# EAGLE design 25062016wearable_v1.1 (EAGLE 7.6.0)
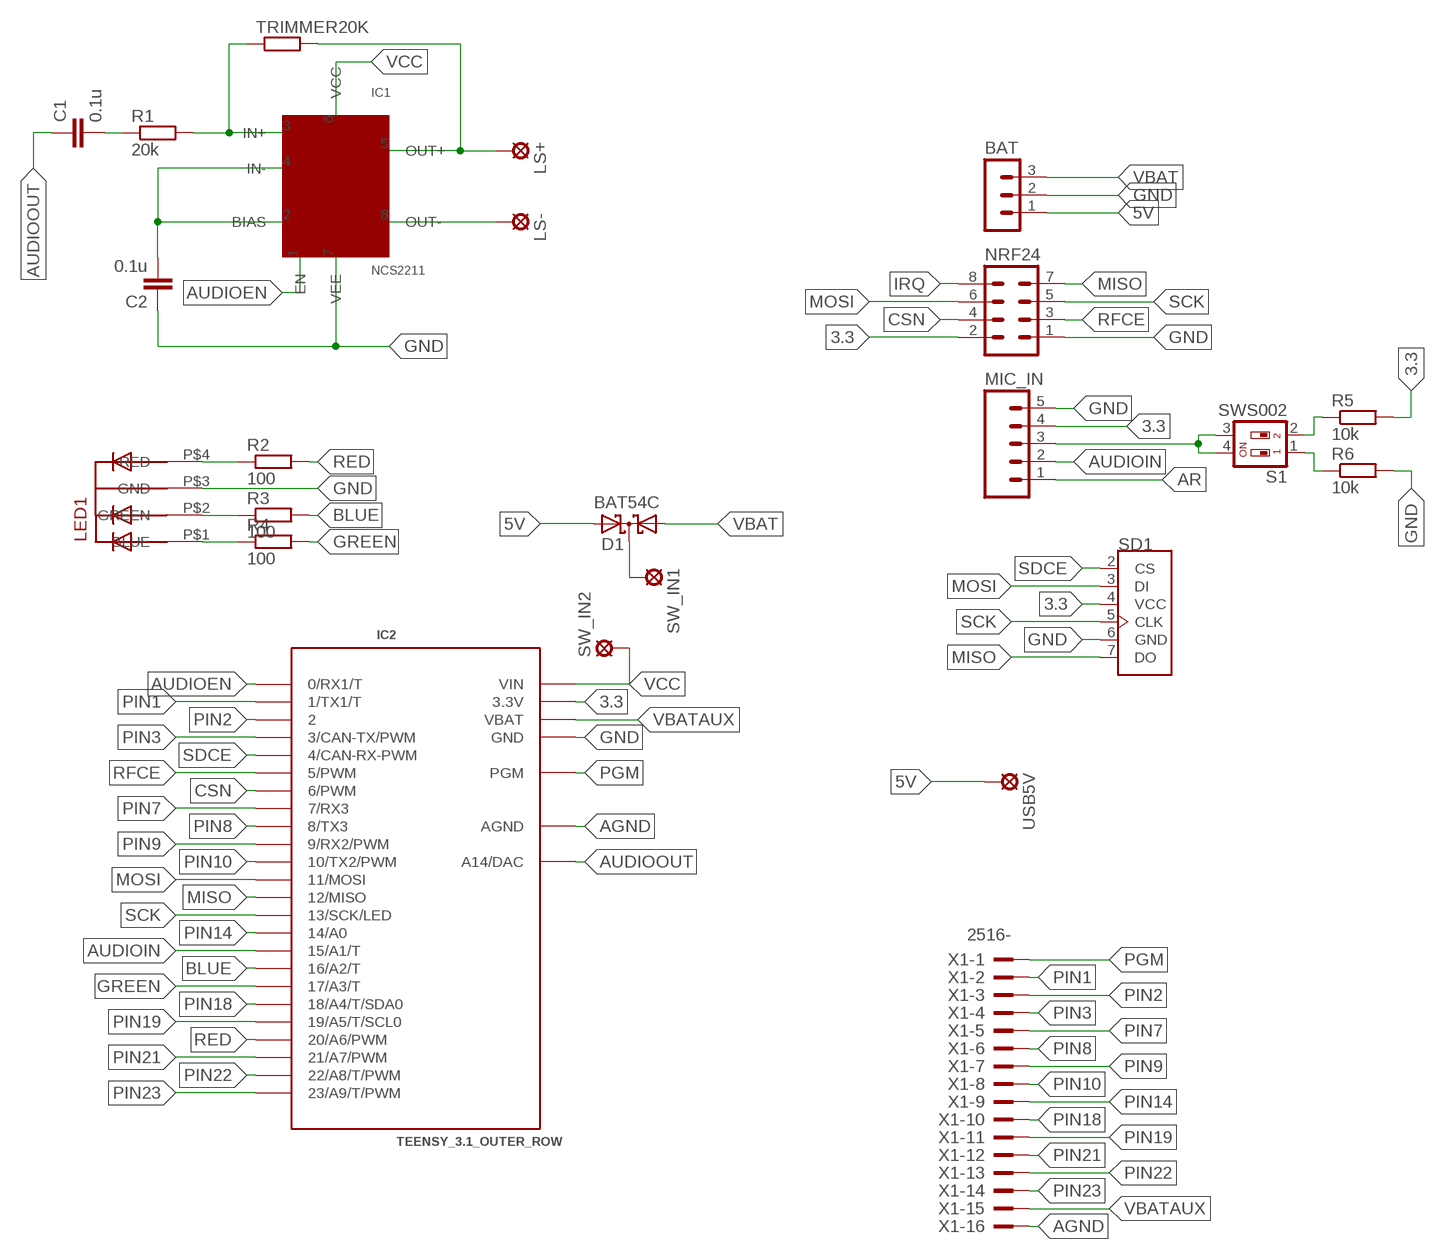
[diagram p0: schematic, sheet 1]

## Parts
BAT  MA03-1  [MA03-1]
C1  0.1u  C2.5/2  [C2.5-2]
C2  0.1u  C2.5/2  [C2.5-2]
D1  BAT54C  [SOT23]
IC1  NCS2211  [SOIC-8]
IC2  TEENSY_3.1_OUTER_ROW  [TEENSY3-OUTER_ROW]
LED1  5MMRGBLED  [LED5MMRGB]
LS+  LSP10  [LSP10]
LS-  LSP10  [LSP10]
MIC_IN  MA05  [05PA]
NRF24  MA04-2  [MA04-2]
R1  20k  R-EU_0204/7  [0204/7]
R2  100  R-EU_0207/2V  [0207/2V]
R3  100  R-EU_0207/2V  [0207/2V]
R4  100  R-EU_0207/2V  [0207/2V]
R5  10k  R-EU_0207/2V  [0207/2V]
R6  10k  R-EU_0207/2V  [0207/2V]
S1  SWS002  [SMS-002]
SD1  MICROSD_SF-MICROSD  [MICROSD_MICROSD]
SW_IN1  SE11  [SE11]
SW_IN2  SE11  [SE11]
TRIMMER20K  R-EU_0207/2V  [0207/2V]
USB5V  LSP10  [LSP10]
X1  2516-  [PAK100/2500-16]

## Nets
3.3 [3.3]: IC2.3.3V IC2.3.3V1(3.3V) MIC_IN.4 NRF24.2 R5.2 SD1.4(VCC)
5V [3.3]: BAT.1 D1.2(A2) USB5V.MP
AGND: IC2.AGND X1.16
AR: MIC_IN.1
AUDIOEN: IC1.1(EN) IC2.0(0/RX1/T)
AUDIOIN: IC2.15/A1(15/A1/T) MIC_IN.2
AUDIOOUT: C1.1 IC2.RESET/DAC(A14/DAC)
BLUE: IC2.16/A2(16/A2/T) R3.2
CSN: IC2.6(6/PWM) NRF24.4
GAIN: MIC_IN.3 S1.3 S1.4
GND [GND]: BAT.2 C2.1 IC1.7(VEE) IC2.GND IC2.GND1(GND) LED1.P$3(GND) MIC_IN.5 NRF24.1 R6.2 SD1.6(GND)
GREEN: IC2.17/A3(17/A3/T) R4.2
IRQ: NRF24.8
MISO: IC2.12(12/MISO) NRF24.7 SD1.7(DO)
MOSI: IC2.11(11/MOSI) NRF24.6 SD1.3(DI)
N$1: D1.3(CC) SW_IN1.MP
N$2: IC1.5(OUT+) LS+.MP TRIMMER20K.2
N$3: IC1.3(IN+) R1.2 TRIMMER20K.1
N$4: C1.2 R1.1
N$5: C2.2 IC1.2(BIAS) IC1.4(IN-)
N$6: IC1.8(OUT-) LS-.MP
N$7: LED1.P$4(RED) R2.1
N$8: LED1.P$1(BLUE) R4.1
N$9: LED1.P$2(GREEN) R3.1
N$11: R5.1 S1.2
N$12: R6.1 S1.1
PGM: IC2.PGM X1.1
PIN1: IC2.1(1/TX1/T) X1.2
PIN2: IC2.2 X1.3
PIN3: IC2.3(3/CAN-TX/PWM) X1.4
PIN7: IC2.7(7/RX3) X1.5
PIN8: IC2.8(8/TX3) X1.6
PIN9: IC2.9(9/RX2/PWM) X1.7
PIN10: IC2.10(10/TX2/PWM) X1.8
PIN14: IC2.14/A0 X1.9
PIN18: IC2.18/A4(18/A4/T/SDA0) X1.10
PIN19: IC2.19/A5(19/A5/T/SCL0) X1.11
PIN21: IC2.21/A7(21/A7/PWM) X1.12
PIN22: IC2.22/A8(22/A8/T/PWM) X1.13
PIN23: IC2.23/A9(23/A9/T/PWM) X1.14
RED: IC2.20/A6(20/A6/PWM) R2.2
RFCE: IC2.5(5/PWM) NRF24.3
SCK: IC2.13(13/SCK/LED) NRF24.5 SD1.5(CLK)
SDCE: IC2.4(4/CAN-RX-PWM) SD1.2(CS)
VBAT [3.3]: BAT.3 D1.1(A1)
VBATAUX: IC2.VBAT X1.15
VCC: IC1.6(VCC) IC2.VIN SW_IN2.MP

## Library data of the parts
BAT = con-lstb:MA03-1: PIN HEADER; OC_FARNELL: unknown; OC_NEWARK: unknown
C1 C2 = capacitor-wima:C: CAPACITOR naming: grid - package width
D1 = diode:BAT54C: Schottky Diodes Source: Fairchild .. BAT54.pdf
IC1 = NCS2211:NCS2211
IC2 = Teensy_3_and_LC_Series_Boards_v1.1:TEENSY_3.1_OUTER_ROW: Footprint for Teensy 3.1 or 3.2 board using all pin connections on the outer perimeter
LED1 = led_rgb:5MMRGBLED
LS+ LS- USB5V = solpad:LSP10: SOLDER PAD drill 1.0 mm, distributor Buerklin, 12H555
MIC_IN = con-amp-quick:MA05: AMP QUICK CONNECTOR; OC_FARNELL: unknown; OC_NEWARK: unknown
NRF24 = con-lstb:MA04-2: PIN HEADER; OC_FARNELL: unknown; OC_NEWARK: unknown
R1-R6 TRIMMER20K = rcl:R-EU_: RESISTOR, European symbol
S1 = smd-special:SWS002: SMD Dip Switch 2 pol.
SD1 = sd:MICROSD_SF-MICROSD
SW_IN1 SW_IN2 = solpad:SE11: SOLDER PAD RTM, drill 1,1mm, distributor Buerklin, 07F810
X1 = con-3m:2516-: 3M (TM) Pak 100 4-Wall Header Source: 3M; OC_FARNELL: unknown; OC_NEWARK: unknown

## Net classes
0 default: width 0.406 mm
1 GND: width 0.61 mm
2 3.3: width 0.61 mm

## Board
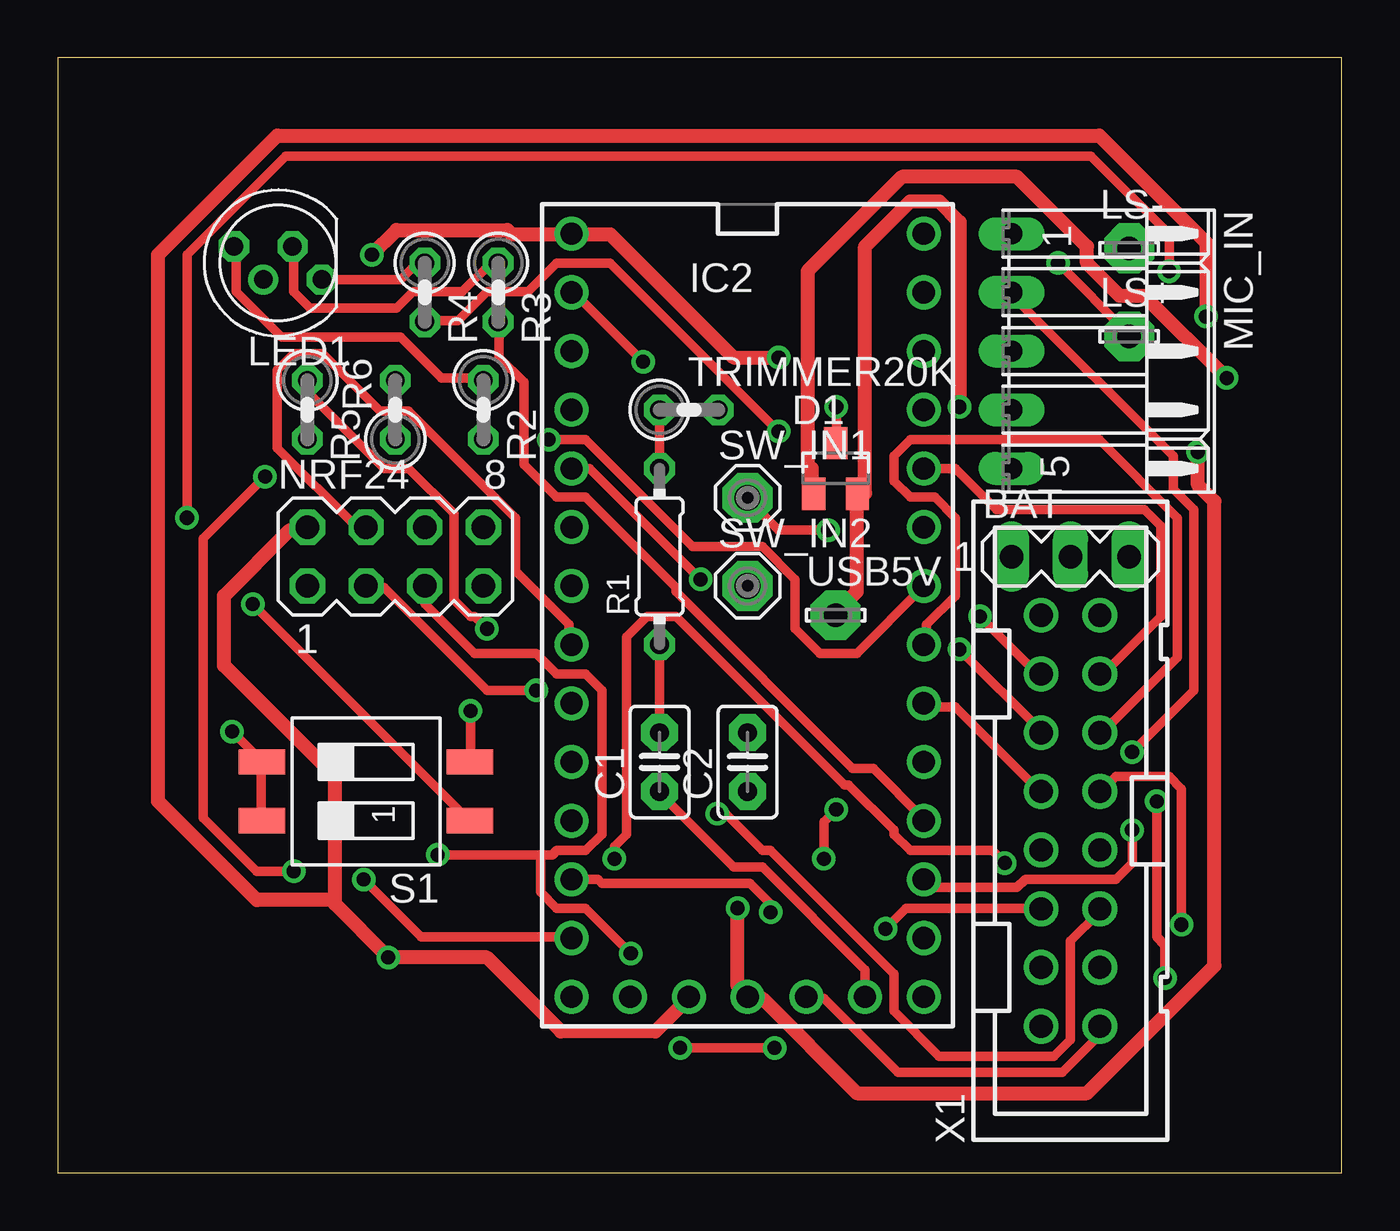
[diagram p1: board, top side]
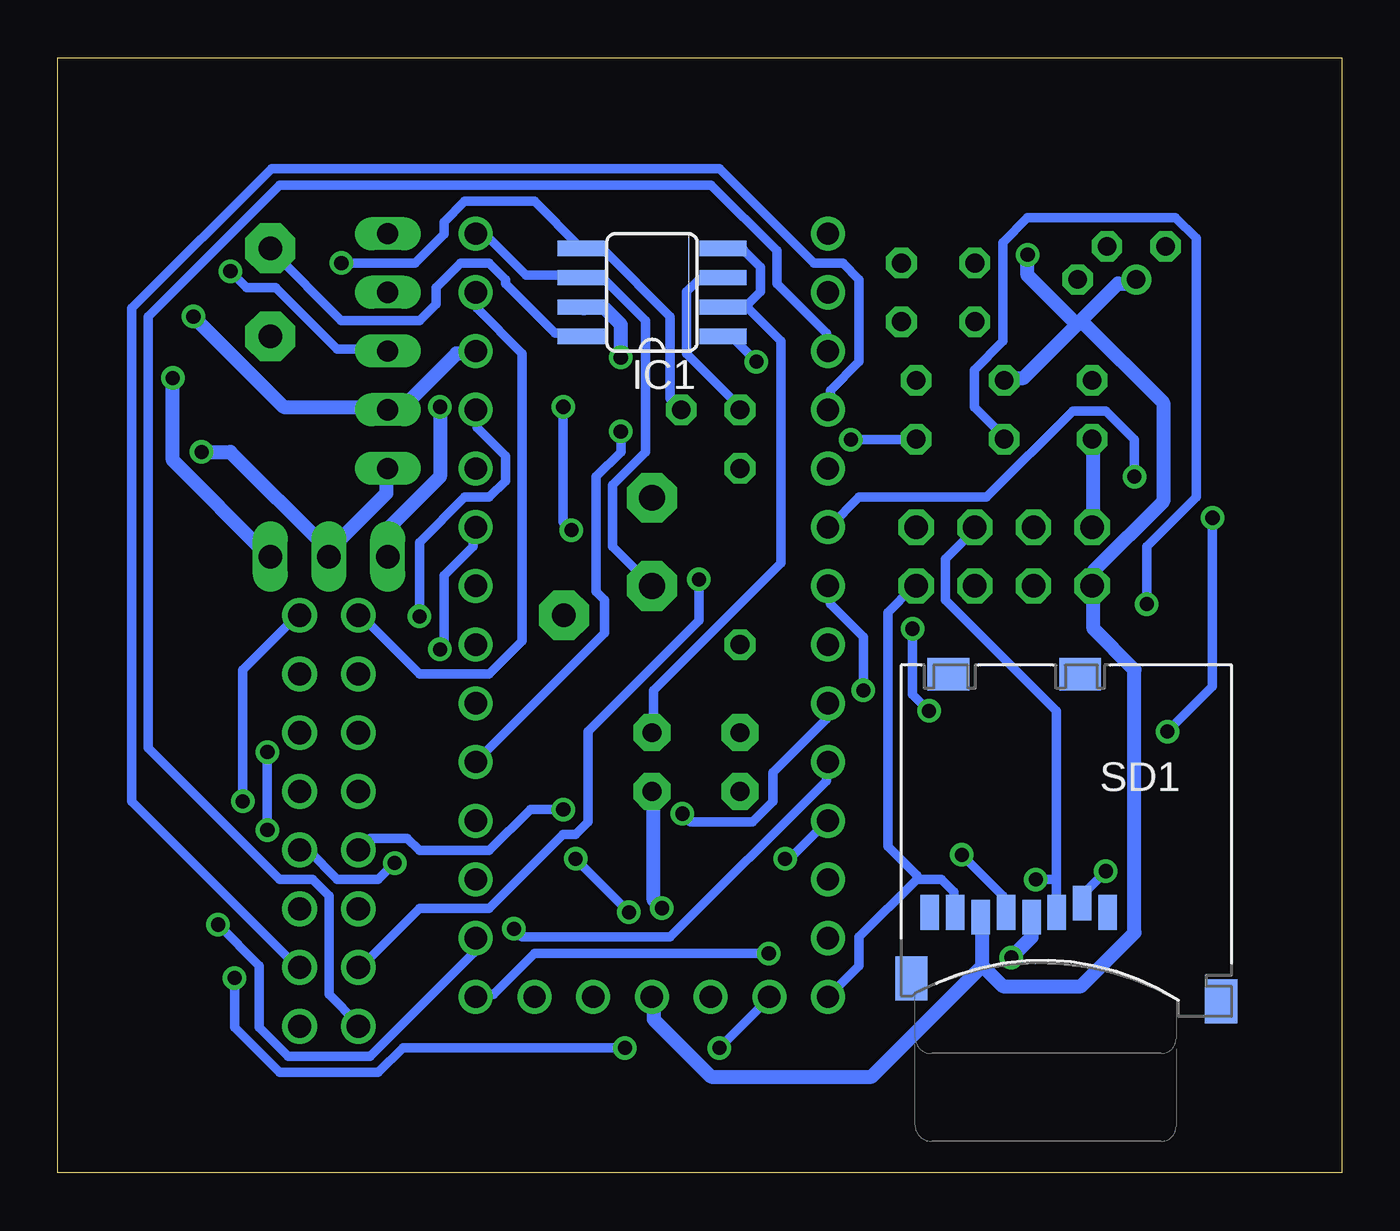
[diagram p2: board, bottom side, seen from below]

Size 55.55 x 48.25 mm. Coordinates in mm from the lower left corner, seen from the top.
Outline: 0,0 55.55,0 55.55,48.25 0,48.25 0,0
Copper layers (1*16): Top 0.035mm / dielectric 1.5mm / Bottom 0.035mm
Design rules "default *": minimum track width 10mil, minimum drill 24mil, track to track 12mil, track to pad 12mil, pad to pad 12mil, via to via 12mil, smd to smd 12mil, copper to edge 40mil, drill to drill 8mil, minimum pad ring 10mil, minimum via ring 8mil, stop-mask expansion 4mil, vias tented up to drill 0mil, thermal gap 10mil

### Footprints (pad centres in the part's own frame; a part is rotated, then mirrored left to right if it is on the bottom)
MA03-1 = drill 1.016 long: 1 -2.54,0; 2 0,0; 3 2.54,0
C2.5-2 = drill 0.813 pad 1.6 octagon: 1 -1.27,0; 2 1.27,0
SOT23 = smd 1 x 1.4: 1 -0.95,-1.1; 2 0.95,-1.1; 3 0,1.1
SOIC-8 = smd 0.66 x 2.032: 1 -1.905,-3.073; 2 -0.635,-3.073; 3 0.635,-3.073; 4 1.905,-3.073; 5 1.905,3.073; 6 0.635,3.073; 7 -0.635,3.073; 8 -1.905,3.073
TEENSY3-OUTER_ROW = drill 0.965: 0 -7.62,13.97; 1 -7.62,11.43; 2 -7.62,8.89; 3 -7.62,6.35; 3.3V 7.62,11.43; 3.3V1 -2.54,-16.51; 4 -7.62,3.81; 5 -7.62,1.27; 6 -7.62,-1.27; 7 -7.62,-3.81; 8 -7.62,-6.35; 9 -7.62,-8.89; 10 -7.62,-11.43; 11 -7.62,-13.97; 12 -7.62,-16.51; 13 7.62,-16.51; 14/A0 7.62,-13.97; 15/A1 7.62,-11.43; 16/A2 7.62,-8.89; 17/A3 7.62,-6.35; 18/A4 7.62,-3.81; 19/A5 7.62,-1.27; 20/A6 7.62,1.27; 21/A7 7.62,3.81; 22/A8 7.62,6.35; 23/A9 7.62,8.89; AGND 7.62,13.97; GND -7.62,16.51; GND1 0,-16.51; PGM 2.54,-16.51; RESET/DAC 5.08,-16.51; VBAT -5.08,-16.51; VIN 7.62,16.51
LED5MMRGB = drill 0.8 pad 0.813 octagon: P$1 -1.905,0.714; P$2 -0.635,-0.714; P$4 1.905,-0.714 | drill 0.8 pad 0.813: P$3 0.635,0.714
LSP10 = drill 1.016 pad 2.159 octagon: MP 0,0
05PA = drill 0.914 long: 1 -5.08,0; 2 -2.54,0; 3 0,0; 4 2.54,0; 5 5.08,0
MA04-2 = drill 1.016 octagon: 1 -3.81,-1.27; 2 -3.81,1.27; 3 -1.27,-1.27; 4 -1.27,1.27; 5 1.27,-1.27; 6 1.27,1.27; 7 3.81,-1.27; 8 3.81,1.27
0204/7 = drill 0.813 octagon: 1 -3.81,0; 2 3.81,0
0207/2V = drill 0.813 octagon: 1 -1.27,0; 2 1.27,0
SMS-002 = smd 1.092 x 2.007: 1 -1.27,-4.496; 2 1.27,-4.496; 3 1.27,4.496; 4 -1.27,4.496
MICROSD_MICROSD = smd 0.8 x 1.5: 1 -1.94,2.7; 2 -0.84,2.3; 3 0.26,2.7; 4 1.36,2.9; 5 2.46,2.7; 6 3.56,2.9; 7 4.66,2.7; 8 5.76,2.7 | smd 1.4 x 1.9: NC -6.85,6.55; NC3 6.55,5.55 | smd 1.8 x 1.4: NC1 -0.75,-7.6; NC2 4.95,-7.6
SE11 = drill 1.118 pad 2.159 octagon: MP 0,0
PAK100/2500-16 = drill 1 pad 1.422: 1 -8.89,-1.27; 2 -8.89,1.27; 3 -6.35,-1.27; 4 -6.35,1.27; 5 -3.81,-1.27; 6 -3.81,1.27; 7 -1.27,-1.27; 8 -1.27,1.27; 9 1.27,-1.27; 10 1.27,1.27; 11 3.81,-1.27; 12 3.81,1.27; 13 6.35,-1.27; 14 6.35,1.27; 15 8.89,-1.27; 16 8.89,1.27

### Placement (x,y rotation side)
BAT  43.82,26.67 0 top
C1  26.04,17.78 90 top
C2  29.84,17.78 90 top
D1  33.66,30.48 0 top
IC1  29.84,38.1 90 bottom
IC2  29.84,24.13 0 top
LED1  9.52,39.37 180 top
LS+  46.36,36.2 0 top
LS-  46.36,40.01 0 top
MIC_IN  41.28,35.56 270 top
NRF24  14.6,26.67 0 top
R1  26.04,26.67 90 top
R2  18.41,33.02 270 top
R3  19.05,38.1 270 top
R4  15.88,38.1 270 top
R5  10.79,33.02 270 top
R6  14.6,33.02 90 top
S1  13.33,16.51 90 top
SD1  12.06,13.97 180 bottom
SW_IN1  29.84,29.21 0 top
SW_IN2  29.84,25.4 0 top
TRIMMER20K  27.3,33.02 0 top
USB5V  33.66,24.13 0 top
X1  43.82,15.24 90 top

### Tracks (layer width: path | path; a pad name or v marks a point on that pad's centre or on a via)
3.3  (via drill 0.61)
  Top 0.61: IC2.3.3V1 27.28,7.54 25.86,6.12 21.77,6.12 18.57,9.32 v14.3,9.32 11.99,11.63 11.99,11.81 | 11.99,11.81 11.99,17.14 7.19,21.95 7.19,24.97 10.03,27.81 10.74,27.81 NRF24.2 | v49.68,37.06 49.68,40.26 45.06,44.88 9.5,44.88 4.34,39.73 4.34,16.08 8.61,11.81 11.99,11.81
  Bottom 0.61: IC2.3.3V 37.59,35.46 38.3,35.46 40.62,33.15 41.15,33.15 MIC_IN.4 41.5,33.15 45.77,33.15 v49.68,37.06 | R5.2 10.74,31.73 10.74,27.99 NRF24.2 | v14.3,9.32 13.41,10.21 13.41,10.92 SD1.4
5V  (via drill 0.61)
  Top 0.61: USB5V.MP 33.68,24.26 34.57,25.15 34.57,29.23 D1.2 34.93,29.41 34.93,40.08 36.88,42.04 38.12,42.04 39.01,41.15 v39.01,33.15
  Bottom 0.61: v39.01,33.15 39.01,30.12 41.15,27.99 41.15,26.75 BAT.1
AGND
  Bottom 0.406: IC2.AGND 37.41,37.95 37.41,37.41 35.46,35.46 35.46,23.01 36.88,21.59 39.9,21.59 42.39,24.08 X1.16
AUDIOEN  (via drill 0.61)
  Top 0.406: v25.32,35.1 22.3,38.12 IC2.0
  Bottom 0.406: v25.32,35.1 26.39,36.17 26.75,36.17 IC1.1
AUDIOIN  (via drill 0.61)
  Top 0.406: v46.48,18.21 49.15,20.88 49.15,28.7 48.26,29.59 48.26,31.01 41.33,37.95 MIC_IN.2 | v46.48,14.83 46.48,13.41 45.77,12.7 41.86,12.7 41.5,12.34 37.95,12.34 37.59,12.7 IC2.15/A1
  Bottom 0.406: v46.48,14.83 v46.48,18.21
AUDIOOUT
  Top 0.406: IC2.RESET/DAC 34.93,8.79 30.48,13.23 29.23,13.23 26.04,16.43 C1.1
BLUE
  Top 0.406: R3.2 19.1,36.7 19.1,35.28 20.17,34.21 20.17,30.66 21.59,29.23 22.84,29.23 26.75,25.32 26.75,25.15 34.39,17.5 35.28,17.5 37.41,15.37 IC2.16/A2
CSN
  Top 0.406: IC2.6 22.12,23.01 22.12,23.72 19.81,26.04 19.81,28.35 15.19,32.97 13.94,32.97 11.46,35.46 10.21,35.46 9.5,34.75 9.5,31.37 12.88,27.99 13.23,27.99 NRF24.4
GAIN  (via drill 0.61)
  Top 0.406: S1.4 8.79,15.37 8.79,17.68 S1.3 8.79,17.86 v7.54,19.1 | v48.08,39.01 48.08,40.62 44.7,43.99 9.85,43.99 5.59,39.73 v5.59,28.35
  Bottom 0.406: v48.08,39.01 47.37,38.3 46.13,38.3 43.46,35.64 41.33,35.64 MIC_IN.3 | v5.59,28.35 5.59,21.06 v7.54,19.1
GND  (via drill 0.61)
  Top 0.61: v31.19,35.28 29.23,35.28 23.9,40.62 22.3,40.62 IC2.GND 21.95,40.62 19.63,40.62 19.46,40.79 14.66,40.79 v13.59,39.73 | v29.41,11.46 29.41,8.08 29.77,7.72 IC2.GND1 30.12,7.54 30.48,7.54 34.57,3.45 44.53,3.45 50.04,8.97 50.04,29.06 49.33,29.77 v49.33,31.19
  Bottom 0.61: v31.19,35.28 31.19,36.7 31.9,37.41 32.79,37.41 IC1.7 | 11.46,36.7 13.77,34.39 14.48,34.39 R6.2 | 11.46,36.7 11.28,36.88 | 11.28,36.88 9.68,38.48 8.97,38.48 LED1.P$3 | 11.28,36.88 7.72,33.33 7.72,29.06 10.74,26.04 10.74,25.5 NRF24.1 10.74,25.15 10.74,23.55 8.97,21.77 8.97,10.39 11.28,8.08 14.66,8.08 15.54,8.97 | v13.59,39.73 13.59,38.84 11.46,36.7 | MIC_IN.5 41.33,30.48 41.33,29.41 43.82,26.92 BAT.2 43.99,27.1 48.08,31.19 v49.33,31.19 | 15.54,8.97 15.54,10.92 SD1.6 | 15.54,8.97 20.34,4.17 27.28,4.17 29.77,6.65 29.77,7.54 IC2.GND1 | v29.41,11.46 29.77,11.81 29.77,16.43 C2.1
GREEN  (via drill 0.61)
  Top 0.406: v31.19,32.08 23.9,39.37 21.59,39.37 20.34,38.12 18.57,38.12 17.32,36.88 15.9,36.88 R4.2
  Bottom 0.406: v31.19,32.08 31.19,31.19 32.26,30.12 32.26,25.15 31.9,24.79 31.9,23.37 37.41,17.86 IC2.17/A3
MISO
  Bottom 0.406: 18.39,12.7 17.32,12.7 16.79,12.17 16.79,11.28 SD1.7 | 18.39,12.7 20.88,10.21 20.88,8.97 IC2.12 | NRF24.7 18.57,25.32 19.63,24.26 19.63,14.12 18.39,12.88 18.39,12.7
MOSI  (via drill 0.61)
  Top 0.406: v13.23,12.7 15.72,10.21 22.12,10.21 IC2.11
  Bottom 0.406: 12.34,12.7 12.34,19.99 17.14,24.79 17.14,26.57 15.9,27.81 NRF24.6 | 12.34,12.7 12.34,11.28 SD1.3 | 12.34,12.7 v13.23,12.7
N$1  (via drill 0.61)
  Top 0.406: v33.68,33.15 33.68,31.73 D1.3 | v33.33,27.81 31.19,27.81 29.95,29.06 SW_IN1.MP
  Bottom 0.406: v33.68,33.15 33.68,28.17 v33.33,27.81
N$2  (via drill 0.61)
  Top 0.406: v43.28,39.37 46.3,36.35 LS+.MP
  Bottom 0.406: TRIMMER20K.2 29.06,33.5 29.06,37.06 31.9,39.9 32.79,39.9 IC1.5 32.97,40.08 34.93,42.04 37.95,42.04 38.84,41.15 38.84,40.62 40.08,39.37 v43.28,39.37
N$3
  Top 0.406: TRIMMER20K.1 R1.2
  Bottom 0.406: IC1.3 26.92,38.66 27.81,38.66 28.35,38.12 28.35,35.46 26.04,33.15 TRIMMER20K.1
N$4
  Top 0.406: C1.2 R1.1
N$5
  Bottom 0.406: 25.68,37.59 26.75,37.59 IC1.2 | 25.68,37.59 25.15,38.12 25.15,39.19 25.86,39.9 26.75,39.9 IC1.4 | 25.68,37.59 25.68,37.41 24.26,35.99 24.26,26.39 29.77,20.88 29.77,19.1 C2.2
N$6
  Bottom 0.406: IC1.8 32.97,36.35 34.04,36.35 36.17,38.48 36.17,38.66 36.88,39.37 38.12,39.37 39.19,38.3 39.19,37.59 39.9,36.88 43.28,36.88 46.3,39.9 LS-.MP
N$7
  Top 0.406: LED1.P$4 7.72,40.08 7.72,38.12 9.68,36.17 14.83,36.17 16.61,34.39 18.39,34.39 R2.1
N$8
  Top 0.406: R4.1 15.54,39.37 14.83,38.66 11.46,38.66 LED1.P$1
N$9
  Top 0.406: R3.1 18.75,39.37 17.5,38.12 15.37,38.12 14.66,37.41 10.92,37.41 10.21,38.12 10.21,40.08 LED1.P$2
N$11  (via drill 0.61)
  Top 0.406: v17.86,19.99 17.86,17.86 S1.2 | v18.57,23.55 18.03,24.08 17.86,24.08 17.14,24.79 17.14,28.52 15.19,30.48 14.12,30.48 10.92,33.68 10.92,34.21 R5.1
  Bottom 0.406: v17.86,19.99 18.57,20.7 v18.57,23.55
N$12  (via drill 0.61)
  Top 0.406: v8.43,24.61 17.68,15.37 S1.1
  Bottom 0.406: v8.43,24.61 8.43,27.1 6.3,29.23 6.3,40.44 7.19,41.33 13.59,41.33 14.66,40.26 14.66,35.99 15.9,34.75 15.9,33.15 14.66,31.9 R6.1
PGM
  Top 0.406: IC2.PGM 32.44,7.54 33.15,7.54 36.35,4.34 43.46,4.34 45.06,5.94 45.06,6.3 X1.1
PIN1
  Bottom 0.406: IC2.1 22.3,35.64 22.3,36.35 24.43,38.48 24.43,39.9 27.28,42.75 45.95,42.75 51.64,37.06 51.64,18.39 45.95,12.7 44.53,12.7 43.82,11.99 43.82,7.72 42.57,6.48 X1.2
PIN2
  Bottom 0.406: IC2.2 22.12,33.15 22.12,33.86 20.88,35.1 20.88,38.66 21.59,39.37 22.84,39.37 26.92,43.46 46.3,43.46 52.35,37.41 52.35,16.08 45.24,8.97 X1.3
PIN3  (via drill 0.61)
  Top 0.406: IC2.3 23.01,30.48 v27.81,25.68
  Bottom 0.406: v27.81,25.68 27.81,23.9 32.61,19.1 32.61,15.19 33.15,14.66 33.68,14.66 36.88,11.46 39.9,11.46 42.39,8.97 X1.4
PIN7  (via drill 0.61)
  Top 0.406: v28.52,15.54 28.88,15.54 30.48,13.95 30.84,13.95 36.17,8.61 36.17,7.01 38.12,5.05 43.1,5.05 43.82,5.77 43.82,10.03 45.06,11.28 X1.5
  Bottom 0.406: v28.52,15.54 28.17,15.19 25.5,15.19 24.61,16.08 24.61,17.32 22.3,19.63 22.3,20.17 IC2.7
PIN8  (via drill 0.61)
  Top 0.406: v35.81,10.57 36.7,11.46 42.39,11.46 X1.6
  Bottom 0.406: v35.81,10.57 35.46,10.21 29.06,10.21 22.3,16.97 22.3,17.68 IC2.8
PIN9  (via drill 0.61)
  Top 0.406: v24.08,13.59 24.08,14.12 24.61,14.66 24.61,23.19 25.5,24.08 26.75,24.08 34.04,16.79 34.21,16.79 36.17,14.83 36.17,14.66 36.88,13.95 40.44,13.95 v40.97,13.41
  Bottom 0.406: v24.08,13.59 23.9,13.59 22.3,15.19 IC2.9 | v40.97,13.41 41.68,12.7 43.46,12.7 44.7,13.95 45.06,13.95 X1.7
PIN10  (via drill 0.61)
  Top 0.406: IC2.10 23.37,12.7 23.55,12.52 29.95,12.52 30.84,11.63 v30.84,11.28 | v33.15,13.59 33.15,15.19 v33.68,15.72
  Bottom 0.406: v33.15,13.59 v30.84,11.28 | v33.68,15.72 35.1,15.72 36.88,13.95 39.9,13.95 40.44,14.48 42.04,14.48 X1.8
PIN14  (via drill 0.61)
  Top 0.406: v48.62,10.74 48.62,16.61 48.08,17.14 45.77,17.14 45.24,16.61 X1.9
  Bottom 0.406: v48.62,10.74 46.84,8.97 46.84,6.3 45.59,5.05 42.04,5.05 37.59,9.5 37.59,10.03 IC2.14/A0
PIN18
  Top 0.406: IC2.18/A4 37.59,20.17 38.84,20.17 42.39,16.61 X1.10
PIN19
  Top 0.406: IC2.19/A5 37.59,23.01 37.59,23.72 38.84,24.97 38.84,28.35 37.95,29.23 36.88,29.23 36.17,29.95 36.17,31.01 36.88,31.73 45.06,31.73 48.44,28.35 48.44,22.3 45.24,19.1 X1.11
PIN21  (via drill 0.61)
  Top 0.406: v39.01,22.66 42.57,19.1 X1.12
  Bottom 0.406: v39.01,22.66 38.84,22.84 38.84,25.86 37.59,27.1 37.59,27.81 IC2.21/A7
PIN22
  Top 0.406: IC2.22/A8 38.84,30.48 40.62,28.7 47.02,28.7 47.73,27.99 47.73,24.08 45.24,21.59 X1.13
PIN23  (via drill 0.61)
  Top 0.406: v39.9,24.08 42.39,21.59 X1.14
  Bottom 0.406: v39.9,24.08 39.9,27.28 37.95,29.23 36.88,29.23 36.17,29.95 36.17,31.01 37.41,32.26 37.41,32.97 IC2.23/A9
RED  (via drill 0.61)
  Top 0.406: v21.23,31.73 22.84,31.73 27.46,27.1 30.48,27.1 31.9,25.68 31.9,23.55 32.97,22.48 34.57,22.48 37.41,25.32 IC2.20/A6
  Bottom 0.406: v21.23,31.73 18.57,31.73 R2.2
RFCE  (via drill 0.61)
  Top 0.406: v20.7,20.88 18.57,20.88 14.12,25.32 13.41,25.32 NRF24.3
  Bottom 0.406: v20.7,20.88 20.7,23.19 22.12,24.61 22.12,25.32 IC2.5
SCK  (via drill 0.61)
  Top 0.406: 20.88,13.77 21.41,13.77 21.59,13.95 22.84,13.95 23.55,14.66 23.55,20.88 22.84,21.59 21.59,21.59 20.7,22.48 18.03,22.48 15.9,24.61 15.9,25.32 NRF24.5 | 20.88,13.77 v16.43,13.77 | v24.79,9.5 22.84,11.46 21.59,11.46 20.88,12.17 20.88,13.77
  Bottom 0.406: v16.43,13.77 14.66,11.99 14.66,11.28 SD1.5 | v24.79,9.5 34.93,9.5 36.7,7.72 37.41,7.72 IC2.13
SDCE  (via drill 0.61)
  Top 0.406: v10.21,13.06 8.61,13.06 6.3,15.37 6.3,27.46 v8.97,30.12
  Bottom 0.406: v10.21,13.06 11.1,12.17 11.1,11.81 SD1.2 | v8.97,30.12 8.97,31.73 10.21,32.97 11.63,32.97 15.37,29.23 20.88,29.23 22.12,27.99 IC2.4
VBAT  (via drill 0.61)
  Top 0.61: v50.57,34.39 47.02,37.95 45.95,37.95 44.53,39.37 44.53,40.08 41.5,43.1 36.53,43.1 32.44,39.01 32.44,30.66 32.61,30.48 32.61,29.41 D1.1
  Bottom 0.61: v50.57,34.39 50.57,30.84 46.48,26.75 BAT.3
VBATAUX  (via drill 0.61)
  Top 0.406: v31.01,5.41 v26.92,5.41 | v47.9,8.43 47.9,9.86 47.55,10.21 v47.55,16.08
  Bottom 0.406: v26.92,5.41 24.79,7.54 IC2.VBAT | v31.01,5.41 40.62,5.41 41.68,4.34 45.95,4.34 47.9,6.3 v47.9,8.43 | v47.55,16.08 47.55,21.77 45.24,24.08 X1.15
VCC
  Bottom 0.406: 32.94,38.81 IC1.6 | 32.79,38.66 IC1.6 | IC1.6 33.15,38.84 35.28,38.84 37.06,40.62 37.41,40.62 IC2.VIN | SW_IN2.MP 31.55,27.1 31.55,29.77 30.12,31.19 30.12,36.88 31.9,38.66 32.61,38.66 IC1.6